# EAGLE design distortion-noise-and-ring-modulator-v1.0 (EAGLE 9.6.2)

## Sheet 1 of 3: Ring modulator
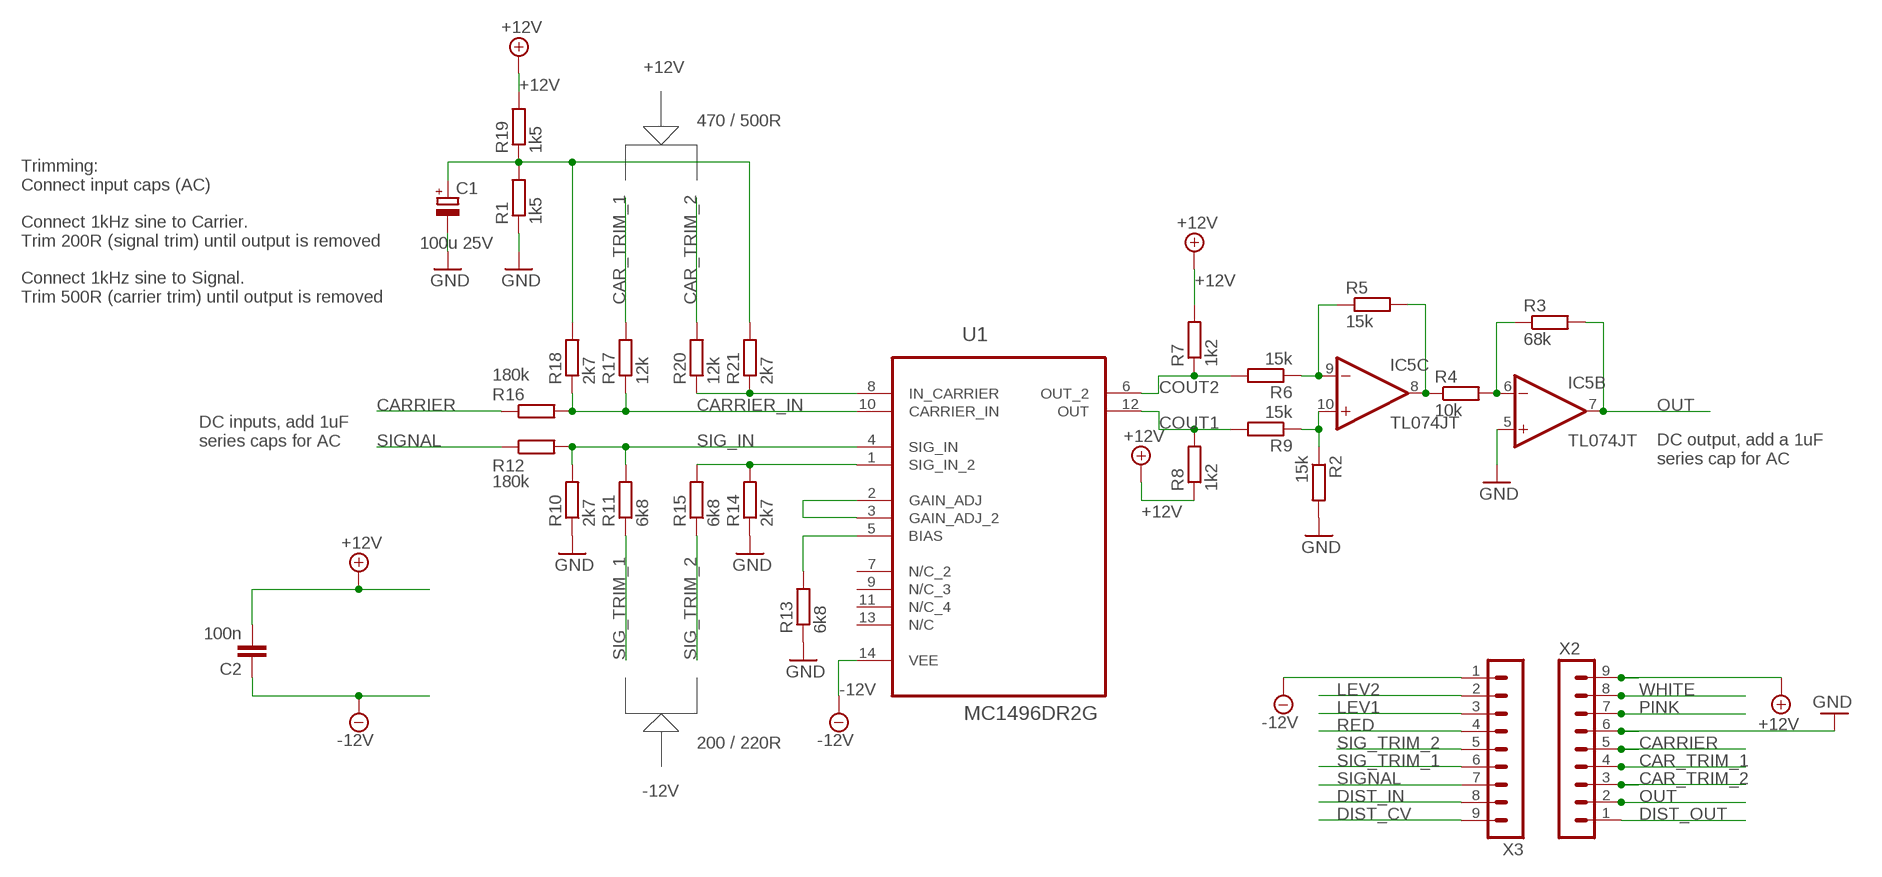
[diagram p0: schematic, sheet 1]

### Parts
C1  100u 25V  CPOL-EUE2-5  [E2-5]
C2  100n  C-EU-J  [C0402-J]
IC5  TL074JT  [TSSOP14J]
R1  1k5  R-EU_R0402  [R0402]
R2  15k  R-EU_R0402  [R0402]
R3  68k  R-EU_R0402  [R0402]
R4  10k  R-EU_R0402  [R0402]
R5  15k  R-EU_R0402  [R0402]
R6  15k  R-EU_R0402  [R0402]
R7  1k2  R-EU_R0402  [R0402]
R8  1k2  R-EU_R0402  [R0402]
R9  15k  R-EU_R0402  [R0402]
R10  2k7  R-EU_R0402  [R0402]
R11  6k8  R-EU_R0402  [R0402]
R12  180k  R-EU_R0402  [R0402]
R13  6k8  R-EU_R0402  [R0402]
R14  2k7  R-EU_R0402  [R0402]
R15  6k8  R-EU_R0402  [R0402]
R16  180k  R-EU_R0402  [R0402]
R17  12k  R-EU_R0402  [R0402]
R18  2k7  R-EU_R0402  [R0402]
R19  1k5  R-EU_R0402  [R0402]
R20  12k  R-EU_R0402  [R0402]
R21  2k7  R-EU_R0402  [R0402]
U1  MC1496DR2G  [SOIC127P600X175-14N]
X2  MA09-1JN  [MA09N-1J]
X3  MA09-1JN  [MA09N-1J]

### Nets
+12V: C2.2 R7.2 R8.1 R19.2 X2.9 ; also sheet 2,3
-12V: C2.1 U1.14(VEE) X3.1 ; also sheet 2,3
CAR_TRIM_1: R17.2 X2.4
CAR_TRIM_2: R20.2 X2.3
CARRIER: R16.1 X2.5
CARRIER_IN: R16.2 R17.1 R18.1 U1.10(CARRIER_IN)
COUT1: R8.2 R9.2 U1.12(OUT)
COUT2: R6.2 R7.1 U1.6(OUT_2)
DIST_CV: X3.9 ; also sheet 3
DIST_IN: X3.8 ; also sheet 3
DIST_OUT: X2.1 ; also sheet 3
GND: C1.- IC5.5(B:+IN) R1.1 R2.2 R10.1 R13.1 R14.1 X2.6 ; also sheet 2,3
LEV1: X3.3 ; also sheet 2
LEV2: X3.2 ; also sheet 2
N$3: R14.2 R15.2 U1.1(SIG_IN_2)
N$8: R20.1 R21.1 U1.8(IN_CARRIER)
N$9: C1.+ R1.2 R18.2 R19.1 R21.2
N$11: R13.2 U1.5(BIAS)
N$12: U1.2(GAIN_ADJ) U1.3(GAIN_ADJ_2)
N$15: IC5.10(C:+IN) R2.1 R9.1
N$16: IC5.9(C:-IN) R5.1 R6.1
N$17: IC5.8(C:OUT) R4.1 R5.2
N$18: IC5.6(B:-IN) R3.1 R4.2
OUT: IC5.7(B:OUT) R3.2 X2.2
PINK: X2.7 ; also sheet 2
RED: X3.4 ; also sheet 2
SIG_IN: R10.2 R11.2 R12.2 U1.4(SIG_IN)
SIG_TRIM_1: R11.1 X3.6
SIG_TRIM_2: R15.1 X3.5
SIGNAL: R12.1 X3.7
WHITE: X2.8 ; also sheet 2
Unconnected: U1.7(N/C_2) U1.9(N/C_3) U1.11(N/C_4) U1.13(N/C)

### Notes on the sheet
- +12V
- 470 / 500R
- Trimming:
  Connect input caps (AC)
  
  Connect 1kHz sine to Carrier. 
  Trim 200R (signal trim) until output is removed
  
  Connect 1kHz sine to Signal. 
  Trim 500R (carrier trim) until output is removed
- DC inputs, add 1uF 
  series caps for AC
- DC output, add a 1uF 
  series cap for AC
- 200 / 220R
- -12V

## Sheet 2 of 3: Noise
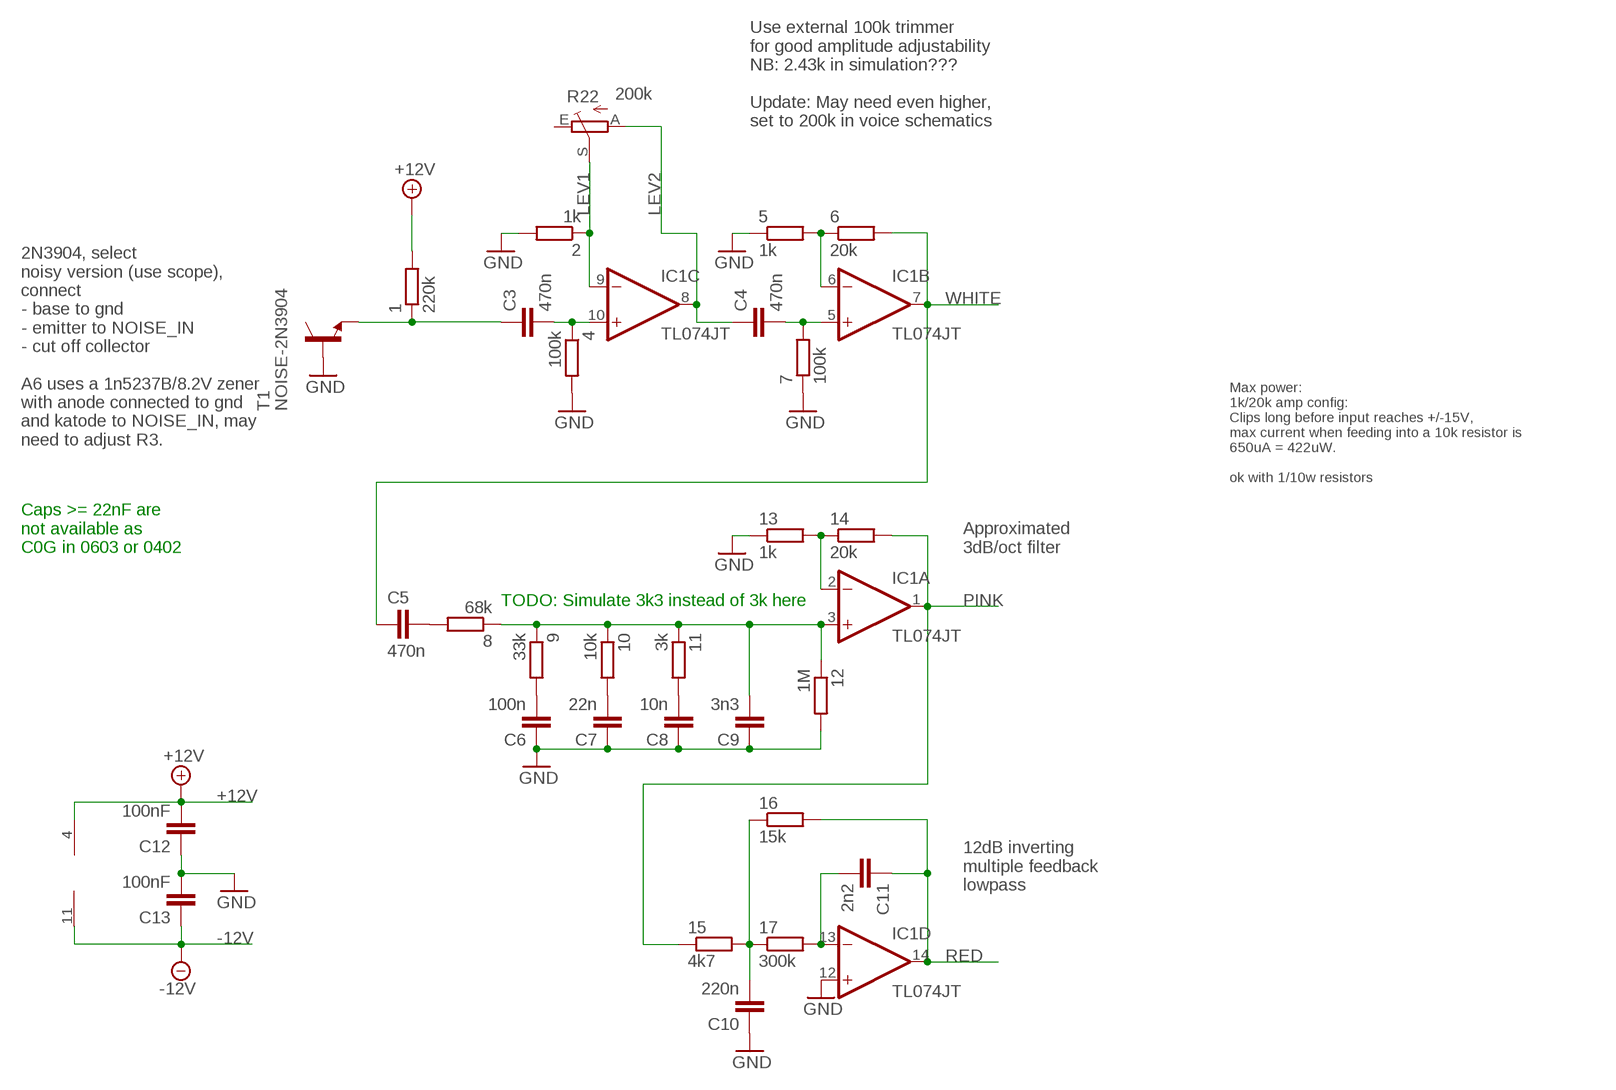
[diagram p1: schematic, sheet 2]

### Parts
1  220k  R-EU_R0402  [R0402]
2  1k  R-EU_R0402  [R0402]
4  100k  R-EU_R0402  [R0402]
5  1k  R-EU_R0402  [R0402]
6  20k  R-EU_R0402  [R0402]
7  100k  R-EU_R0402  [R0402]
8  68k  R-EU_R0402  [R0402]
9  33k  R-EU_R0402  [R0402]
10  10k  R-EU_R0402  [R0402]
11  3k  R-EU_R0402  [R0402]
12  1M  R-EU_R0402  [R0402]
13  1k  R-EU_R0402  [R0402]
14  20k  R-EU_R0402  [R0402]
15  4k7  R-EU_R0402  [R0402]
16  15k  R-EU_R0402  [R0402]
17  300k  R-EU_R0402  [R0402]
C3  470n  C-EU-J  [C0402-J]
C4  470n  C-EU-J  [C0402-J]
C5  470n  C-EU-J  [C0402-J]
C6  100n  C-EU-J  [C0402-J]
C7  22n  C-EU-J  [C0402-J]
C8  10n  C-EU-J  [C0402-J]
C9  3n3  C-EU-J  [C0402-J]
C10  220n  C-EU-J  [C0402-J]
C11  2n2  C-EU-J  [C0402-J]
C12  100nF  C-EU-J  [C0402-J]
C13  100nF  C-EU-J  [C0402-J]
IC1  TL074JT  [TSSOP14J]
R22  200k  TRIM_EU-S64W  [S64W]
T1  NOISE-2N3904  [NOISE-2N3904-J]

### Nets
+12V: 1.2 C12.2 IC1.4(P:V+) ; also sheet 1,3
-12V: C13.1 IC1.11(P:V-) ; also sheet 1,3
GND: 2.2 4.2 5.1 7.1 12.2 13.1 C6.1 C7.1 C8.1 C9.1 C10.1 C12.1 C13.2 IC1.12(D:+IN) T1.B ; also sheet 1,3
LEV1: 2.1 IC1.9(C:-IN) R22.S ; also sheet 1
LEV2: C4.1 IC1.8(C:OUT) R22.A ; also sheet 1
N$1: 13.2 14.1 IC1.2(A:-IN)
N$2: 5.2 6.1 IC1.6(B:-IN)
N$4: 9.2 C6.2
N$5: 10.2 C7.2
N$6: 11.2 C8.2
N$7: 1.1 C3.1 T1.E
N$10: 4.1 C3.2 IC1.10(C:+IN)
N$13: 7.2 C4.2 IC1.5(B:+IN)
N$14: 8.1 9.1 10.1 11.1 12.1 C9.2 IC1.3(A:+IN)
N$19: 8.2 C5.2
N$20: 15.2 16.1 17.1 C10.2
N$21: 17.2 C11.2 IC1.13(D:-IN)
PINK: 14.2 15.1 IC1.1(A:OUT) ; also sheet 1
RED: 16.2 C11.1 IC1.14(D:OUT) ; also sheet 1
WHITE: 6.2 C5.1 IC1.7(B:OUT) ; also sheet 1
Unconnected: R22.E

### Notes on the sheet
- Use external 100k trimmer 
  for good amplitude adjustability
  NB: 2.43k in simulation???
  
  Update: May need even higher, 
  set to 200k in voice schematics
- 2N3904, select
  noisy version (use scope),
  connect 
  - base to gnd
  - emitter to NOISE_IN
  - cut off collector
  
  A6 uses a 1n5237B/8.2V zener
  with anode connected to gnd 
  and katode to NOISE_IN, may
  need to adjust R3.
- Max power:
  1k/20k amp config:
  Clips long before input reaches +/-15V,
  max current when feeding into a 10k resistor is
  650uA = 422uW. 
  
  ok with 1/10w resistors
- Caps >= 22nF are
  not available as 
  C0G in 0603 or 0402
- Approximated
  3dB/oct filter
- TODO: Simulate 3k3 instead of 3k here
- 12dB inverting
  multiple feedback
  lowpass

## Sheet 3 of 3: Distortion
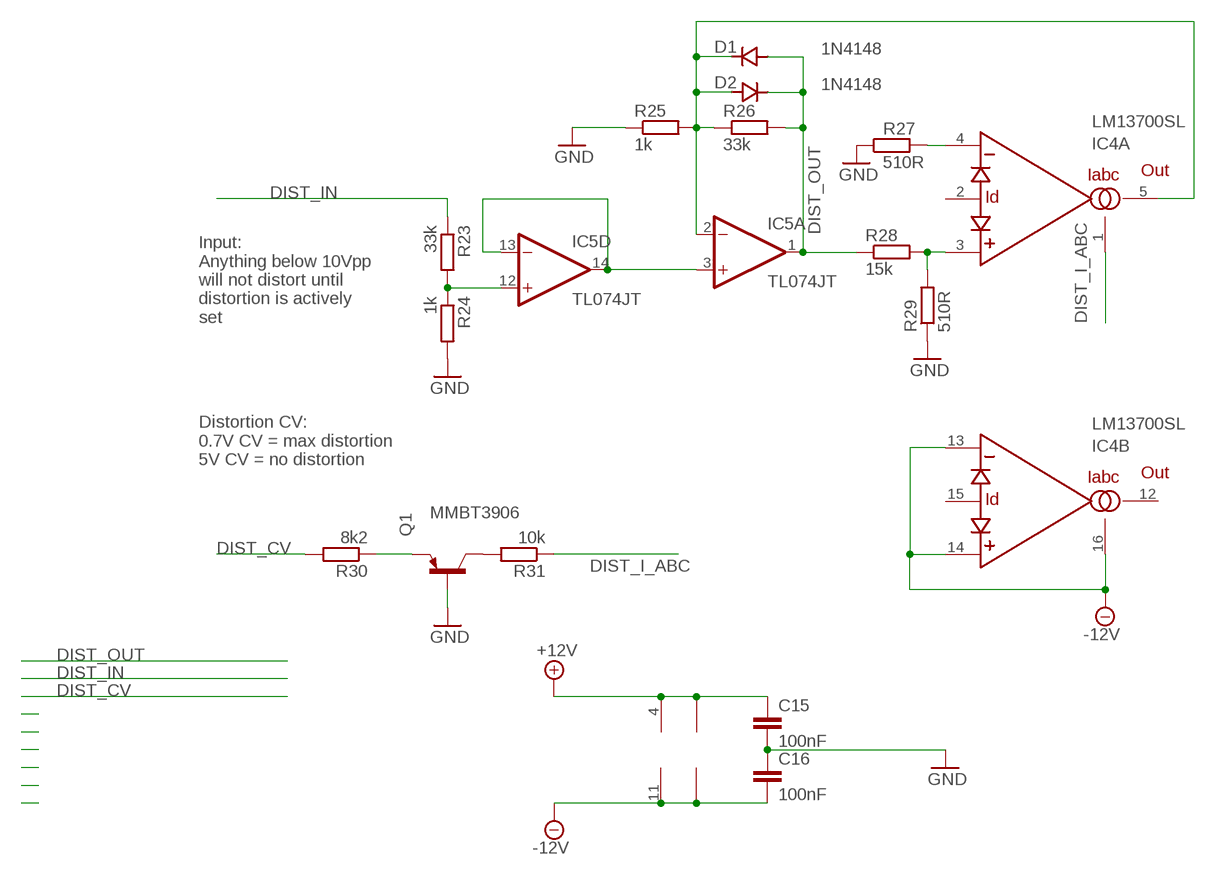
[diagram p2: schematic, sheet 3]

### Parts
C15  100nF  C-EU-J  [C0402-J]
C16  100nF  C-EU-J  [C0402-J]
D1  1N4148  1N4148SOD323  [SOD323J]
D2  1N4148  1N4148SOD323  [SOD323J]
IC4  LM13700SL  [SO16-NARROW-J]
Q1  MMBT3906  MMBT3906LT1SMD  [SOT23-BEC]
R23  33k  R-EU_R0402  [R0402]
R24  1k  R-EU_R0402  [R0402]
R25  1k  R-EU_R0402  [R0402]
R26  33k  R-EU_R0402  [R0402]
R27  510R  R-EU_R0402  [R0402]
R28  15k  R-EU_R0402  [R0402]
R29  510R  R-EU_R0402  [R0402]
R30  8k2  R-EU_R0402  [R0402]
R31  10k  R-EU_R0402  [R0402]

### Nets
+12V: C15.1 IC4.11(V+) IC5.4(P:V+) ; also sheet 1,2
-12V: C16.2 IC4.6(V-) IC4.13(B:-IN) IC4.14(B:+IN) IC4.16(B:IABC) IC5.11(P:V-) ; also sheet 1,2
DIST_CV: R30.2 ; also sheet 1
DIST_I_ABC: IC4.1(A:IABC) R31.1
DIST_IN: R23.1 ; also sheet 1
DIST_OUT: D1.2(A) D2.1(C) IC5.1(A:OUT) R26.2 R28.1 ; also sheet 1
GND: C15.2 C16.1 Q1.B R24.2 R25.1 R27.1 R29.1 ; also sheet 1,2
N$22: IC5.12(D:+IN) R23.2 R24.1
N$23: IC5.3(A:+IN) IC5.13(D:-IN) IC5.14(D:OUT)
N$24: D1.1(C) D2.2(A) IC4.5(A:OUT) IC5.2(A:-IN) R25.2 R26.1
N$25: IC4.4(A:-IN) R27.2
N$26: IC4.3(A:+IN) R28.2 R29.2
N$27: Q1.E R30.1
N$28: Q1.C R31.2
Unconnected: IC4.2(A:ID) IC4.7(IN) IC4.8(OUT) IC4.9(OUT) IC4.10(IN) IC4.12(B:OUT) IC4.15(B:ID)

### Notes on the sheet
- Input:
  Anything below 10Vpp
  will not distort until
  distortion is actively
  set
- Distortion CV:
  0.7V CV = max distortion
  5V CV = no distortion

## Library data of the parts
1 2 4-17 R1-R21 R23-R31 = rcl:R-EU_: RESISTOR, European symbol; SPICEPREFIX: R
C1 = rcl:CPOL-EU: POLARIZED CAPACITOR, European symbol; SPICEPREFIX: C
C2-C13 C15 C16 = joakim:C-EU-J: CAPACITOR, European symbol
D1 D2 = joakim:1N4148: DIODE high speed (Philips)
IC1 IC5 = joakim:TL074J: OP AMP
IC4 = joakim:LM13700: National Dual OTA with buffers.
Q1 = transistor-pnp:MMBT3906*: PNP Transistror
R22 = pot:TRIM_EU-: POTENTIOMETER
T1 = joakim:NOISE-2N3904: 2N3904 with the collector cut, used as a noise source
U1 = ON Semiconductor_By_element14_Batch_1:MC1496DR2G: Balanced Modulators/Demodulators; MPN: MC1496DR2G; OC_FARNELL: 1651904; OC_NEWARK: 45J1148; PACKAGE: SOIC-14; SUPPLIER: ON SEMICONDUCTOR
X2 X3 = joakim:MA09-1J: PIN HEADER

## Board
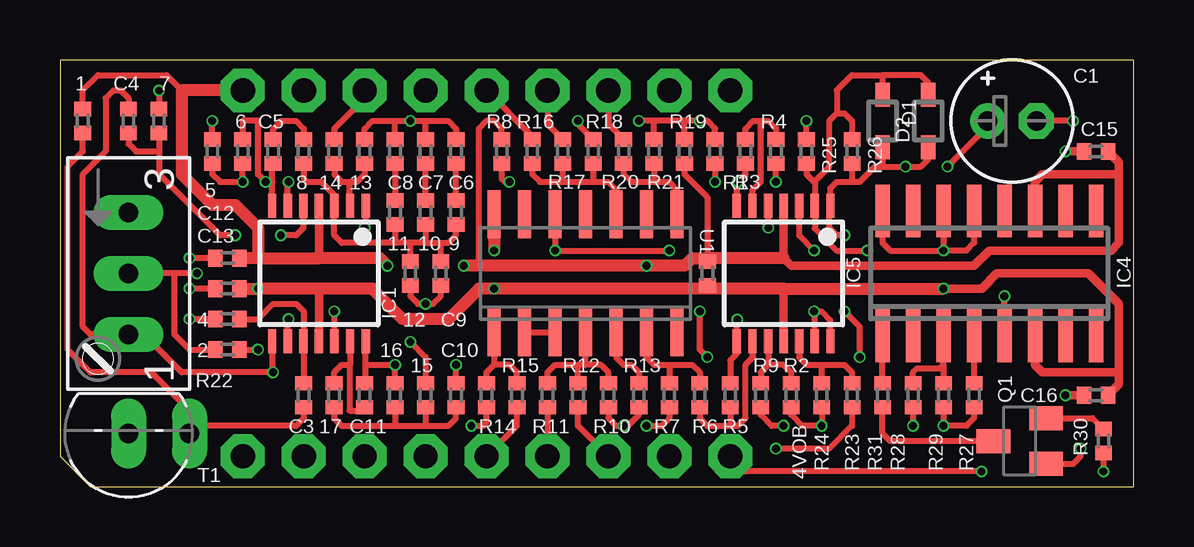
[diagram p3: board, top side]
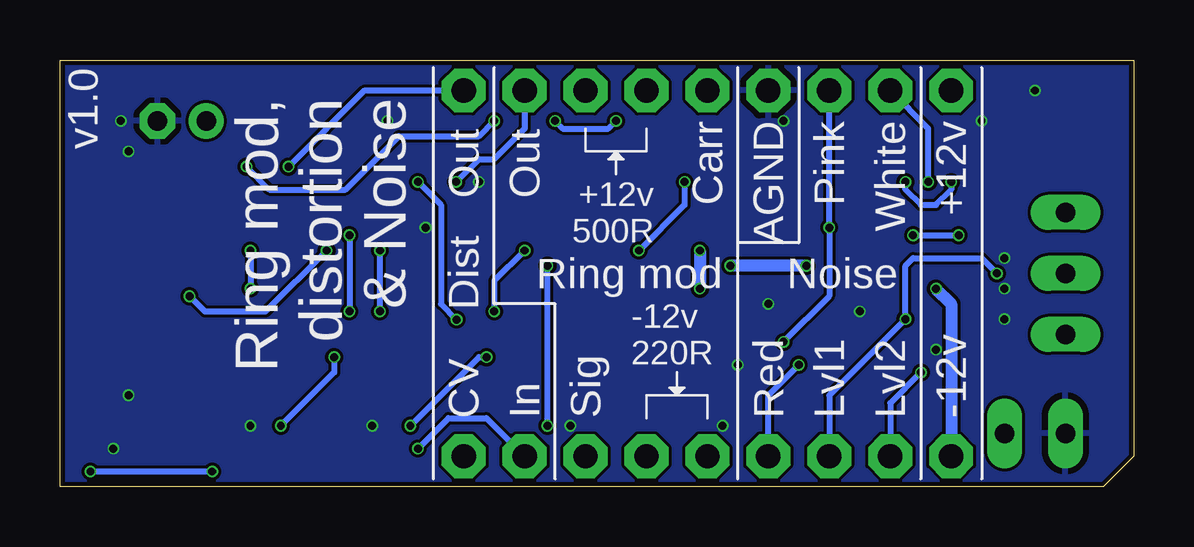
[diagram p4: board, bottom side, seen from below]

Size 44.77 x 17.78 mm. Coordinates in mm from the lower left corner, seen from the top.
Outline: 1.27,0 44.77,0 44.77,17.78 0,17.78 0,1.27 1.27,0
Copper layers (1*16): Top 0.035mm / dielectric 1.6mm / Bottom 0.035mm
Design rules "jlcpcb-2layers": minimum track width 5mil, minimum drill 0.3mm, track to track 5mil, track to pad 5mil, pad to pad 5mil, via to via 5mil, smd to smd 5mil, copper to edge 0.2mm, drill to drill 6mil, minimum pad ring 10mil, minimum via ring 3mil, stop-mask expansion 4mil, vias tented up to drill 0mil, thermal gap 10mil

### Footprints (pad centres in the part's own frame; a part is rotated, then mirrored left to right if it is on the bottom)
R0402 = smd 0.6 x 0.7: 1 -0.5,0; 2 0.5,0
E2-5 = drill 0.813 pad 1.27: + -1.016,0 | drill 0.813 pad 1.27 octagon: - 1.016,0
C0402-J = smd 0.6 x 0.7: 1 -0.5,0; 2 0.5,0
SOD323J = smd 1 x 0.6: 1 -1.1,0; 2 1.1,0
TSSOP14J = smd 0.35 x 1: 1 -1.95,-2.825; 2 -1.3,-2.825; 3 -0.65,-2.825; 4 0,-2.825; 5 0.65,-2.825; 6 1.3,-2.825; 7 1.95,-2.825; 8 1.95,2.825; 9 1.3,2.825; 10 0.65,2.825; 11 0,2.825; 12 -0.65,2.825; 13 -1.3,2.825; 14 -1.95,2.825
SO16-NARROW-J = smd 0.6 x 2.2: 1 -4.445,-2.6; 2 -3.175,-2.6; 3 -1.905,-2.6; 4 -0.635,-2.6; 5 0.635,-2.6; 6 1.905,-2.6; 7 3.175,-2.6; 8 4.445,-2.6; 9 4.445,2.6; 10 3.175,2.6; 11 1.905,2.6; 12 0.635,2.6; 13 -0.635,2.6; 14 -1.905,2.6; 15 -3.175,2.6; 16 -4.445,2.6
SOT23-BEC = smd 1 x 1.4: B -0.95,-1.1; C 0,1.1; E 0.95,-1.1
S64W = drill 0.813 long: A 2.54,1.27; E -2.54,1.27; S 0,1.27
NOISE-2N3904-J = drill 0.813 long: B 0,0; E -2.54,0
SOIC127P600X175-14N = smd 1.981 x 0.533: 1 -2.464,3.81; 2 -2.464,2.54; 3 -2.464,1.27; 4 -2.464,0; 5 -2.464,-1.27; 6 -2.464,-2.54; 7 -2.464,-3.81; 8 2.464,-3.81; 9 2.464,-2.54; 10 2.464,-1.27; 11 2.464,0; 12 2.464,1.27; 13 2.464,2.54; 14 2.464,3.81
MA09N-1J = drill 1.016 octagon: 1 -10.16,0; 2 -7.62,0; 3 -5.08,0; 4 -2.54,0; 5 0,0; 6 2.54,0; 7 5.08,0; 8 7.62,0; 9 10.16,0

### Placement (x,y rotation side)
1  0.95,15.24 90 top
2  6.99,5.71 0 top
4  6.99,6.99 180 top
5  6.35,13.97 270 top
6  7.62,13.97 90 top
7  4.13,15.24 270 top
8  10.16,13.97 90 top
9  16.51,11.43 90 top
10  15.24,11.43 90 top
11  13.97,11.43 90 top
12  14.61,8.89 270 top
13  12.7,13.97 270 top
14  11.43,13.97 90 top
15  15.24,3.81 270 top
16  13.97,3.81 90 top
17  11.43,3.81 90 top
C1  39.69,15.24 0 top
C2  26.99,8.89 90 top
C3  10.16,3.81 90 top
C4  2.86,15.24 270 top
C5  8.89,13.97 90 top
C6  16.51,13.97 270 top
C7  15.24,13.97 270 top
C8  13.97,13.97 270 top
C9  15.88,8.89 90 top
C10  16.51,3.81 270 top
C11  12.7,3.81 270 top
C12  6.99,9.53 0 top
C13  6.99,8.26 180 top
C15  43.18,13.97 180 top
C16  43.18,3.81 0 top
D1  34.29,15.24 270 top
D2  36.2,15.24 90 top
IC1  10.79,8.89 180 top
IC4  38.73,8.89 0 top
IC5  30.16,8.89 180 top
Q1  40.01,1.91 90 top
R1  27.3,13.97 90 top
R2  30.48,3.81 270 top
R3  28.57,13.97 270 top
R4  29.84,13.97 90 top
R5  27.94,3.81 90 top
R6  26.67,3.81 90 top
R7  25.4,3.81 270 top
R8  18.41,13.97 270 top
R9  29.21,3.81 270 top
R10  22.86,3.81 90 top
R11  20.32,3.81 90 top
R12  21.59,3.81 90 top
R13  24.13,3.81 90 top
R14  17.78,3.81 90 top
R15  19.05,3.81 90 top
R16  19.68,13.97 270 top
R17  20.95,13.97 90 top
R18  22.23,13.97 90 top
R19  26.04,13.97 270 top
R20  23.5,13.97 90 top
R21  24.77,13.97 90 top
R22  1.59,8.89 270 top
R23  33.02,3.81 90 top
R24  31.75,3.81 270 top
R25  31.11,13.97 270 top
R26  33.02,13.97 270 top
R27  38.1,3.81 90 top
R28  35.56,3.81 90 top
R29  36.83,3.81 90 top
R30  43.5,1.91 270 top
R31  34.29,3.81 270 top
T1  2.86,2.22 180 top
U1  21.91,8.89 90 top
X2  17.78,16.51 180 top
X3  17.78,1.27 0 top

### Tracks (layer width: path | path; a pad name or v marks a point on that pad's centre or on a via)
+12V  (via drill 0.33)
  Top 0.254: R19.2 26.04,13.02 26.99,12.06 26.99,9.53 | R8.1 18.41,14.92 18.1,15.24 17.78,15.24 17.46,14.92 17.46,9.21 | 1.2 0.95,16.51 1.59,17.14 4.45,17.14 5.08,16.51 | R7.2 25.4,2.86 25.08,2.54 v24.45,2.54
  Top 0.356: IC1.4 10.79,9.53 | 44.13,13.02 44.13,13.52 C15.1 | 44.13,13.02 40.96,13.02 40.64,12.7 IC4.11 | 44.13,13.02 44.13,10.16 43.81,9.84 38.73,9.84 38.1,9.21 30.48,9.21 30.16,9.53 IC5.4
  Top 0.508: 26.99,9.53 26.35,9.53 26.04,9.21 v24.45,9.21 17.46,9.21 v16.83,9.21 | C2.2 26.99,9.53 | 8.26,9.53 C12.2 | v13.65,9.21 13.34,9.53 10.79,9.53 8.26,9.53 | X2.9 5.08,16.51 5.08,13.02 6.35,11.75 7.3,11.75 8.26,10.79 8.26,9.53 | 30.16,9.53 26.99,9.53
  Bottom 0.254: v24.45,2.54 v24.45,9.21
  Bottom 0.508: v13.65,9.21 v16.83,9.21
-12V  (via drill 0.33)
  Top 0.254: IC4.14 v36.83,9.84 | IC4.16 34.29,10.16 34.61,9.84 v36.83,9.84 | IC4.13 38.1,10.16 37.78,9.84 v36.83,9.84
  Top 0.356: IC1.11 10.79,8.26 | C16.2 44.13,4.26 44.13,4.76 | 44.13,4.76 44.13,7.62 42.86,8.89 39.05,8.89 38.42,8.26 v36.83,8.26 | IC4.6 40.64,5.08 40.96,4.76 44.13,4.76 | IC5.11 30.16,8.26
  Top 0.508: U1.14 v18.1,9.84 | 26.99,8.26 30.16,8.26 v36.83,8.26 | 26.99,8.26 v18.1,8.26 17.46,8.26 16.19,6.99 14.29,6.99 13.02,8.26 10.79,8.26 v8.26,8.26 C13.1 | C2.1 26.99,8.26
  Bottom 0.254: v36.83,9.84 v36.83,8.26
  Bottom 0.508: v18.1,9.84 v18.1,8.26 | v8.26,8.26 7.62,7.62 X3.1
CAR_TRIM_1
  Top 0.254: X2.4 20.32,15.11 R17.2
CAR_TRIM_2
  Top 0.254: X2.3 22.86,15.11 R20.2
CARRIER
  Top 0.254: R16.1 19.68,14.61 X2.5
CARRIER_IN
  Top 0.254: R16.2 19.68,13.02 20,12.7 20.95,12.7 | 20.95,12.7 22.23,12.7 | 22.23,12.7 22.86,12.7 23.18,12.38 U1.10 | R18.1 22.23,12.7 | R17.1 20.95,12.7
COUT1  (via drill 0.33)
  Top 0.254: v30.16,2.54 29.66,2.54 29.21,2.99 R9.2 | v26.99,5.4 26.67,5.71 v26.67,7.3 | v18.73,12.7 18.55,12.7 18.41,12.84 R8.2 | U1.12 v20.64,9.84 v25.4,9.84
  Bottom 0.254: v30.16,2.54 27.3,5.4 v26.99,5.4 | v18.73,12.7 18.73,11.75 v20.64,9.84 | v25.4,9.84 26.67,8.57 v26.67,7.3
COUT2
  Top 0.254: U1.6 24.45,5.4 24.77,5.08 25.4,5.08 | R6.2 26.67,4.76 26.35,5.08 25.4,5.08 | 25.4,5.08 R7.1
DIST_CV  (via drill 0.33)
  Top 0.254: R30.2 v43.5,0.64 | v38.42,0.64 28.57,0.64 X3.9
  Bottom 0.254: v43.5,0.64 v38.42,0.64
DIST_I_ABC
  Top 0.254: R31.1 IC4.1
DIST_IN  (via drill 0.33)
  Top 0.254: R23.1 33.02,2.54 32.07,1.59 v29.84,1.59
  Bottom 0.254: X3.8 26.99,2.86 28.57,2.86 v29.84,1.59
DIST_OUT  (via drill 0.33)
  Top 0.254: R26.2 33.02,12.7 | D1.2 34.29,13.34 | 34.29,13.34 33.97,13.34 33.34,12.7 33.02,12.7 | 34.29,13.34 v35.24,13.34 35.88,13.34 36.2,13.65 D2.1 | 33.02,12.7 32.38,12.7 32.11,12.43 IC5.1 32.07,11.67 32.07,10.79 32.38,10.48 v32.7,10.48 | R28.1 v35.56,2.54 | v33.34,5.4 33.34,6.67 v32.7,7.3
  Bottom 0.254: v35.56,2.54 33.34,4.76 v33.34,5.4 | v35.24,13.34 32.07,16.51 X2.1 | v32.7,10.48 v32.7,7.3
GND  (via drill 0.33)
  Top 0.254: R13.1 24.13,2.99 23.68,2.54 v23.5,2.54 23.18,2.54 22.86,2.86 R10.1 | v17.14,2.54 17.64,2.54 17.78,2.67 R14.1 | R1.1 v27.3,12.7 | v42.23,15.24 C1.- | R2.2 30.48,2.99 30.93,2.54 v31.75,2.54 R24.2 | 13.1 12.7,14.92 13.02,15.24 13.97,15.24 | 13.97,15.24 v14.61,15.24 15.24,15.24 | 15.24,15.24 16.19,15.24 16.51,14.92 C6.1 | C7.1 15.24,15.24 | C8.1 13.97,15.24 | IC1.12 11.45,7.29 v11.43,7.3 | 12.2 14.61,7.94 14.92,7.62 v15.24,7.62 15.56,7.62 15.88,7.94 C9.1 | 5.1 v6.35,15.24 | v4.13,16.51 7.1 | C12.1 v5.4,9.53 | C13.2 v5.4,8.26 | 4.2 v5.4,6.99 | C10.1 v16.51,5.08 | 2.2 v8.26,5.71 | IC5.5 29.51,10.81 v29.53,10.79 | R25.1 v31.11,15.24 | R29.1 v36.83,2.54 37.78,2.54 38.1,2.86 R27.1 | Q1.B 42.23,0.95 42.55,1.27 v42.55,1.59
  Top 0.356: C16.1 v41.91,3.81 | C15.2 v41.91,13.97
  pour Bottom: 45.4,18.41 45.4,-0.64 -0.64,-0.64 -0.64,18.41
LEV1  (via drill 0.33)
  Top 0.254: IC1.9 9.49,6.96 v9.53,6.99 | v5.71,8.89 4.76,8.89 | 4.76,8.89 R22.S | 2.1 5.4,5.71 4.76,6.35 4.76,8.89
  Bottom 0.254: v5.71,8.89 6.35,9.53 9.21,9.53 9.53,9.21 v9.53,6.99 12.7,3.81 X3.3
LEV2  (via drill 0.33)
  Top 0.254: IC1.8 8.85,4.76 | 8.85,4.76 5.08,4.76 3.49,6.35 R22.A 1.27,6.35 0.95,6.67 0.95,13.02 1.91,13.97 1.91,16.19 2.22,16.51 2.54,16.51 2.86,16.19 C4.1 | v8.88,4.76 8.85,4.76
  Bottom 0.254: v8.88,4.76 10.16,3.48 X3.2
N$1
  Top 0.254: 13.2 12.7,13.02 12.38,12.7 12.06,12.7 | 14.1 11.45,13.46 11.45,13.03 11.43,13.02 11.75,12.7 12.06,12.7 | IC1.2 12.06,11.74 12.06,12.7
N$2  (via drill 0.33)
  Top 0.254: 5.2 6.35,13.02 6.67,12.7 v7.62,12.7 6.1 | IC1.6 9.49,12.67 v9.53,12.7
  Bottom 0.254: v7.62,12.7 7.62,12.38 8.26,11.75 8.89,11.75 9.53,12.38 v9.53,12.7
N$3
  Top 0.254: U1.1 18.1,5.08 | R15.2 19.05,4.76 18.73,5.08 18.1,5.08 | R14.2 17.78,4.76 18.1,5.08
N$4
  Top 0.254: 9.2 C6.2
N$5
  Top 0.254: 10.2 C7.2
N$6
  Top 0.254: C8.2 11.2
N$7
  Top 0.254: C3.1 10.16,2.86 9.84,2.54 5.71,2.54 T1.E 5.4,3.17 3.81,4.76 1.27,4.76 0.33,5.71 0.33,13.35 0.95,13.97 1.1
N$8
  Top 0.254: R20.1 23.5,13.02 23.81,12.7 24.77,12.7 | 24.77,12.7 25.4,12.7 25.72,12.38 U1.8 | R21.1 24.77,12.7
N$9  (via drill 0.33)
  Top 0.254: R1.2 27.3,14.92 26.99,15.24 v26.67,15.24 26.04,15.24 | 26.04,15.24 24.77,15.24 | 24.77,15.24 v24.13,15.24 | R19.1 26.04,15.24 | R18.2 21.59,15.11 v21.59,15.24 | C1.+ 38.42,14.76 v36.99,13.34 | R21.2 24.77,15.24
  Bottom 0.254: v21.59,15.24 21.91,14.92 23.81,14.92 v24.13,15.24 | v36.99,13.34 36.04,12.38 32.87,12.38 30.64,14.61 27.3,14.61 v26.67,15.24
N$10
  Top 0.254: 4.1 8.26,6.99 8.89,7.62 9.84,7.62 10.16,7.3 10.16,6.08 IC1.10 10.16,6.05 C3.2
N$11
  Top 0.254: U1.5 23.18,5.4 23.5,5.08 23.81,5.08 24.13,4.76 R13.2
N$12
  Top 0.254: U1.2 U1.3
N$13  (via drill 0.33)
  Top 0.254: C4.2 2.86,14.29 3.17,13.97 4.13,13.97 | IC1.5 10.14,10.78 9.84,10.48 v9.21,10.48 | v7.3,10.48 6.67,10.48 4.13,13.02 4.13,13.97 | 7.2 4.13,13.97
  Bottom 0.254: v9.21,10.48 v7.3,10.48
N$14
  Top 0.254: 9.1 16.51,10.48 16.19,10.16 15.88,10.16 | 11.1 13.97,10.16 | 12.1 14.61,10.16 | C9.2 15.88,10.16 | 10.1 15.24,10.16 | 15.24,10.16 14.61,10.16 | 14.61,10.16 13.97,10.16 | 15.24,10.16 15.88,10.16 | 8.1 10.16,12.84 10.29,12.7 10.89,12.7 11.45,12.15 IC1.3 11.43,11.7 11.43,10.48 11.75,10.16 13.97,10.16
N$15
  Top 0.254: R2.1 30.48,4.76 30.16,5.08 29.53,5.08 | 29.53,5.08 29.21,4.76 R9.1 | IC5.10 29.53,6.05 29.53,5.08
N$16
  Top 0.254: R6.1 26.67,2.86 26.99,2.54 27.94,2.54 | R5.1 27.94,2.54 | 27.94,2.54 28.26,2.54 28.57,2.86 28.57,5.08 28.89,5.4 28.89,6.04 IC5.9
N$17  (via drill 0.33)
  Top 0.254: R5.2 27.94,5.26 28.21,5.54 IC5.8 28.21,6.94 v28.23,6.96 | v29.84,12.7 R4.1
  Bottom 0.254: v29.84,12.7 28.89,11.75 28.89,7.62 v28.23,6.96
N$18
  Top 0.254: IC5.6 28.86,12.35 29.21,12.7 29.21,15.24 | R3.1 28.57,14.92 28.89,15.24 29.21,15.24 | R4.2 29.84,14.92 29.53,15.24 29.21,15.24
N$19
  Top 0.254: C5.2 8.89,14.92 9.21,15.24 9.84,15.24 10.16,14.92 8.2
N$20
  Top 0.254: 17.1 11.43,2.86 11.75,2.54 13.97,2.54 | 13.97,2.54 15.24,2.54 | 15.24,2.54 16.19,2.54 16.51,2.86 C10.2 | 15.2 15.24,2.54 | 16.1 13.97,2.54
N$21
  Top 0.254: 17.2 11.43,4.76 11.75,5.08 12.06,5.08 | C11.2 12.56,3.17 12.06,3.17 12.06,5.08 | IC1.13 12.1,5.11 12.06,5.08
N$22
  Top 0.254: IC5.12 30.81,5.38 31.11,5.08 31.75,5.08 | R23.2 33.02,4.76 32.7,5.08 31.75,5.08 | R24.1 31.75,5.08
N$23  (via drill 0.33)
  Top 0.254: IC5.14 32.11,6.94 31.75,7.3 v31.43,7.3 31.46,7.27 IC5.13 | v31.43,9.84 30.81,10.46 IC5.3
  Bottom 0.254: v31.43,7.3 v31.43,9.84
N$24  (via drill 0.33)
  Top 0.254: R25.2 31.11,13.02 31.46,12.67 | 31.46,12.67 IC5.2 31.46,10.77 32.38,9.84 v33.66,9.84 | 31.46,12.67 31.46,12.73 32.07,13.34 32.07,15.24 32.38,15.56 | R26.1 33.02,15.24 32.7,15.56 32.38,15.56 | D2.2 36.2,16.83 35.88,17.14 34.29,17.14 | 34.29,17.14 D1.1 | 34.29,17.14 33.02,17.14 32.38,16.51 32.38,15.56 | IC4.5 v39.37,7.94
  Bottom 0.254: v33.66,9.84 36.2,7.3 38.73,7.3 v39.37,7.94
N$25
  Top 0.254: IC4.4 R27.2
N$26
  Top 0.254: 36.83,5.08 R29.2 | 36.83,5.08 IC4.3 | R28.2 35.56,4.76 35.73,4.94 36.69,4.94 36.83,5.08
N$27
  Top 0.254: Q1.E 43.05,2.85 R30.1
N$28
  Top 0.254: Q1.C 34.61,1.91 34.29,2.22 R31.2
OUT  (via drill 0.33)
  Top 0.254: IC5.7 28.21,12.65 v28.26,12.7 28.57,13.02 R3.2
  Bottom 0.254: v28.26,12.7 27.3,13.65 26.67,13.65 25.4,14.92 X2.2
PINK  (via drill 0.33)
  Top 0.254: 14.2 11.43,14.92 12.7,16.19 X2.7 | v12.7,10.79 12.74,10.84 IC1.1 | v14.61,6.03 15.24,5.4 15.1
  Bottom 0.254: X2.7 v12.7,10.79 12.7,7.94 v14.61,6.03
RED  (via drill 0.33)
  Top 0.254: 16.2 v13.97,5.08 12.74,5.08 | C11.1 12.74,4.36 12.74,5.08 | 12.74,5.08 IC1.14
  Bottom 0.254: v13.97,5.08 15.24,3.81 X3.4
SIG_IN
  Top 0.254: R11.2 20.32,4.76 20.64,5.08 21.59,5.08 | 21.91,5.08 U1.4 | R12.2 21.59,5.08 | R10.2 22.86,4.76 22.54,5.08 21.91,5.08 | 21.91,5.08 21.59,5.08
SIG_TRIM_1
  Top 0.254: R11.1 X3.6
SIG_TRIM_2
  Top 0.254: X3.5 19.05,2.54 R15.1
SIGNAL
  Top 0.254: X3.7 21.59,2.54 R12.1
WHITE  (via drill 0.33)
  Top 0.254: 6.2 7.62,15.24 8.26,15.24 8.26,13.02 v8.57,12.7 8.85,12.7 | IC1.7 8.85,12.7 | 8.85,12.7 8.85,13.43 C5.1
  Bottom 0.254: X2.8 8.57,14.92 v8.57,12.7

### Text on the board
tNames: 4VOB
bNames: v1.0 | Ring mod, / distortion / & Noise | +12v | White | Pink | AGND | Carr | Out | Out | +12v / 500R | Noise | Ring mod | Dist | -12v / 220R | -12v | Lvl2 | Lvl1 | Red | Sig | In | CV